# EAGLE design MJ828 - POC (EAGLE 9.4.0)
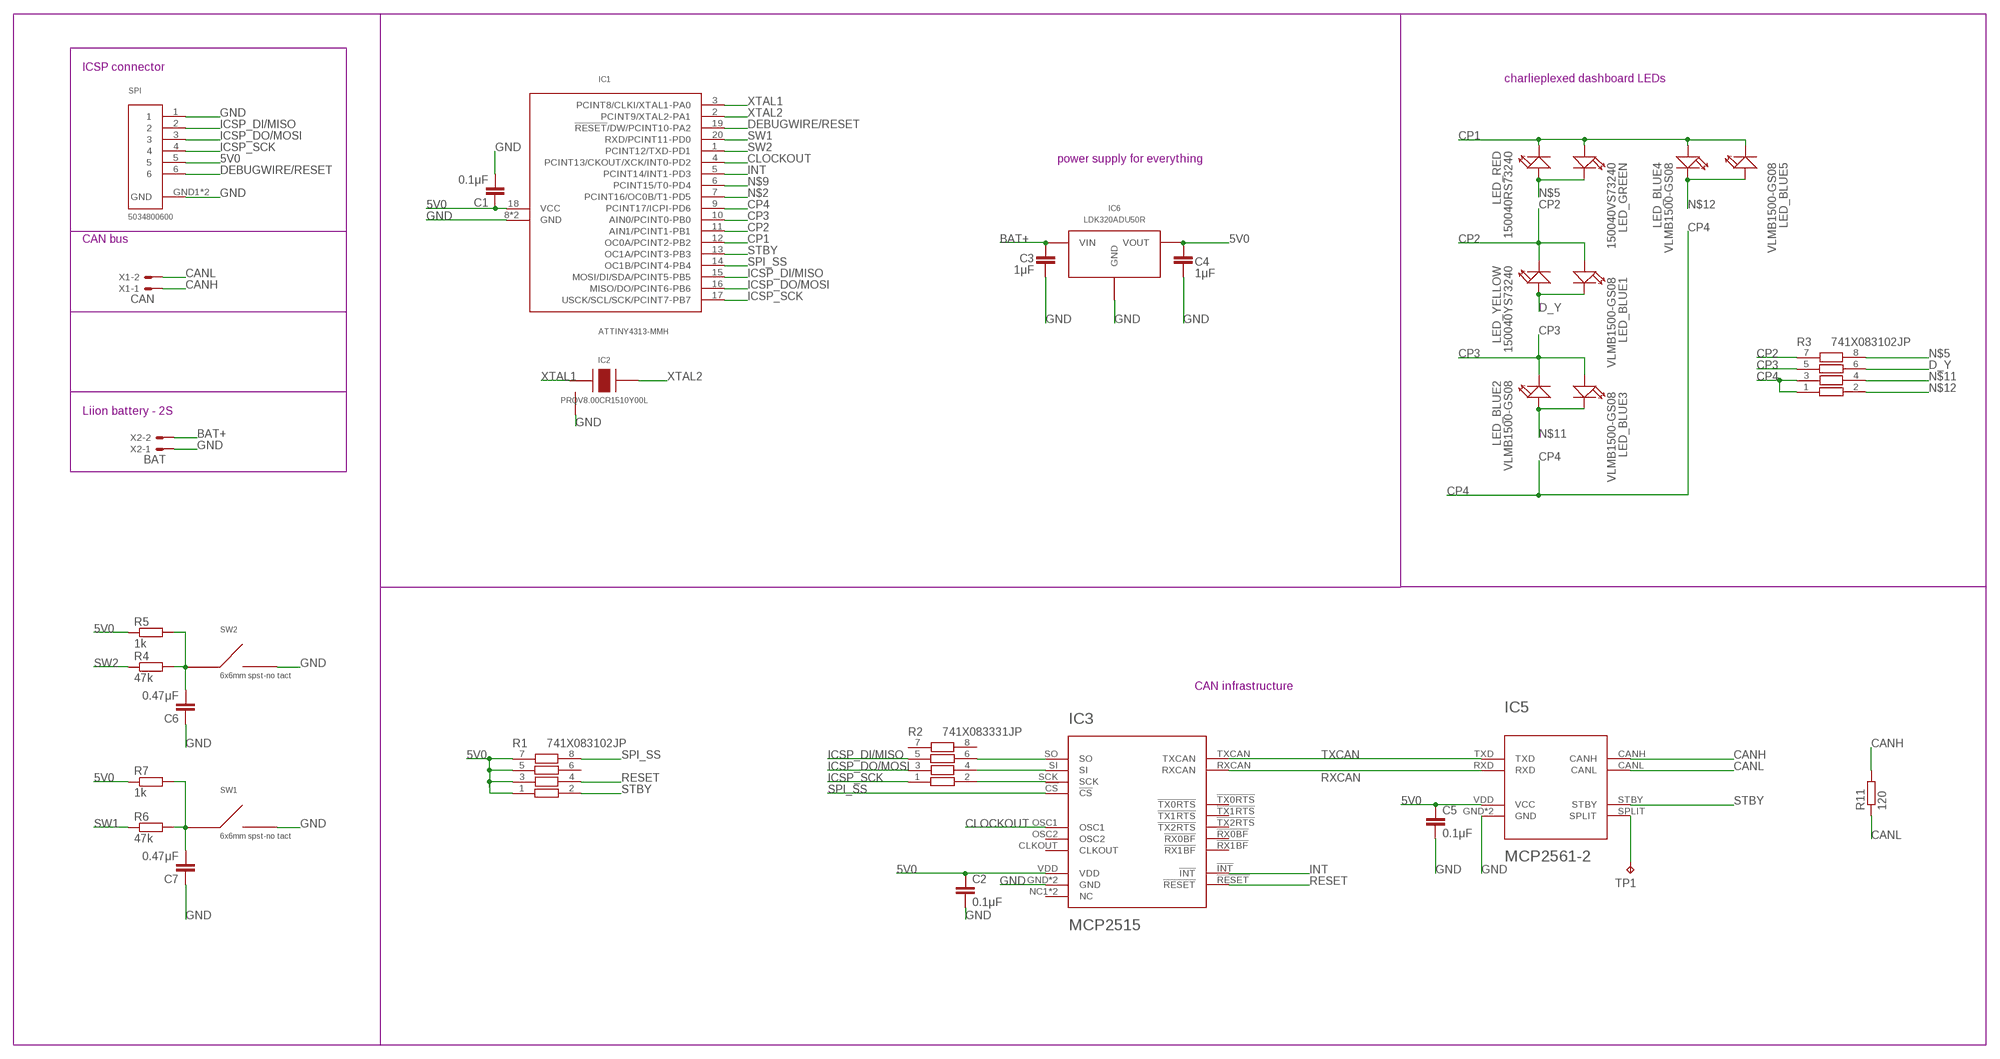
[diagram p0: schematic, sheet 1]

## Parts
C1  0.1μF  C-EUC0402  [C0402]
C2  0.1μF  C-EUC0402  [C0402]
C3  1μF  C-EUC0402  [C0402]
C4  1μF  C-EUC0402  [C0402]
C5  0.1μF  C-EUC0402  [C0402]
C6  0.47μF  C-EUC0402  [C0402]
C7  0.47μF  C-EUC0402  [C0402]
IC1  ATTINY4313-MMH  ATTINY4313VQFN-20  [VQFN-20]
IC2  PRQV8.00CR1510Y00L  PRQV  [SMT]
IC3  MCP2515  MCP2515-I-ML  [QFN20]
IC5  MCP2561-2  [DFN10]
IC6  LDK320ADU50R  LDO  [SOT-89]
LED_BLUE1  VLMB1500-GS08  SMD-LED-CLEAR-BLUE(0402)  [LED-0402]
LED_BLUE2  VLMB1500-GS08  SMD-LED-CLEAR-BLUE(0402)  [LED-0402]
LED_BLUE3  VLMB1500-GS08  SMD-LED-CLEAR-BLUE(0402)  [LED-0402]
LED_BLUE4  VLMB1500-GS08  SMD-LED-CLEAR-BLUE(0402)  [LED-0402]
LED_BLUE5  VLMB1500-GS08  SMD-LED-CLEAR-BLUE(0402)  [LED-0402]
LED_GREEN  150040VS73240  SMD-LED-CLEAR-BLUE(0402)  [LED-0402]
LED_RED  150040RS73240  SMD-LED-CLEAR-BLUE(0402)  [LED-0402]
LED_YELLOW  150040YS73240  SMD-LED-CLEAR-BLUE(0402)  [LED-0402]
R1  741X083102JP  741X083331JP  [0402]
R2  741X083331JP  [0402]
R3  741X083102JP  741X083331JP  [0402]
R4  47k  R-EU_R0402  [R0402]
R5  1k  R-EU_R0402  [R0402]
R6  47k  R-EU_R0402  [R0402]
R7  1k  R-EU_R0402  [R0402]
R11  120  R-EU_R0805  [R0805]
SPI  5034800600  [SMT]
SW1  6x6mm spst-no tact  TL3305-844809  [SMD]
SW2  6x6mm spst-no tact  TL3305-844809  [SMD]
TP1  TPB2,54  [B2,54]
X1  CAN  22-23-2021  [22-23-2021]
X2  BAT  22-23-2021  [22-23-2021]

## Nets
5V0 [5V0CAN]: C1.1 C2.1 C4.2 C5.1 IC1.18(VCC) IC3.VDD IC5.VDD(VCC) IC6.VOUT R1.1 R1.3 R1.5 R1.7 R5.1 R7.1 SPI.5
BAT+ [currett-0.45]: C3.1 IC6.VIN X2.2
CANH [signal]: IC5.CANH R11.2 X1.1
CANL [signal]: IC5.CANL R11.1 X1.2
CLOCKOUT [signal]: IC1.4(PCINT13/CKOUT/XCK/INT0-PD2) IC3.OSC1
CP1 [signal]: IC1.12(OC0A/PCINT2-PB2) LED_BLUE4.+ LED_BLUE5.- LED_GREEN.+ LED_RED.-
CP2 [signal]: IC1.11(AIN1/PCINT1-PB1) LED_BLUE1.+ LED_YELLOW.- R3.7
CP3 [signal]: IC1.10(AIN0/PCINT0-PB0) LED_BLUE2.- LED_BLUE3.+ R3.5
CP4 [signal]: IC1.9(PCINT17/ICPI-PD6) R3.1 R3.3
D_Y [signal]: LED_BLUE1.- LED_YELLOW.+ R3.6
DEBUGWIRE/RESET [signal]: IC1.19(!RESET!/DW/PCINT10-PA2) SPI.6
GND: C1.2 C2.2 C3.2 C4.1 C5.2 C6.1 C7.1 IC1.8(GND) IC1.GND IC2.GND IC3.GND IC3.GND6(GND) IC5.GND IC5.VSS(GND) IC6.GND SPI.1 SPI.GND1(GND) SPI.GND2(GND) SW1.3 SW1.4 SW2.3 SW2.4 X2.1
ICSP_DI/MISO [signal]: IC1.15(MOSI/DI/SDA/PCINT5-PB5) R2.5 SPI.2
ICSP_DO/MOSI [signal]: IC1.16(MISO/DO/PCINT6-PB6) R2.3 SPI.3
ICSP_SCK [signal]: IC1.17(USCK/SCL/SCK/PCINT7-PB7) R2.1 SPI.4
INT [signal]: IC1.5(PCINT14/INT1-PD3) IC3.!INT!
N$1: C6.2 R4.2 R5.2 SW2.1 SW2.2
N$2: IC1.7(PCINT16/OC0B/T1-PD5)
N$5 [signal]: LED_GREEN.- LED_RED.+ R3.8
N$7: C7.2 R6.2 R7.2 SW1.1 SW1.2
N$9: IC1.6(PCINT15/T0-PD4)
N$11 [signal]: LED_BLUE2.+ LED_BLUE3.- R3.4
N$12 [signal]: LED_BLUE4.- LED_BLUE5.+ R3.2
RESET [signal]: IC3.!RESET! R1.4
RXCAN [signal]: IC3.RXCAN IC5.RXD
SPI_SCK [signal]: IC3.SCK R2.2
SPI_SI [signal]: IC3.SI R2.4
SPI_SO [signal]: IC3.SO R2.6
SPI_SS [signal]: IC1.14(OC1B/PCINT4-PB4) IC3.!CS! R1.8
SPLIT: IC5.SPLIT TP1.TP
STBY [signal]: IC1.13(OC1A/PCINT3-PB3) IC5.STBY R1.2
SW1 [signal]: IC1.20(RXD/PCINT11-PD0) R6.1
SW2 [signal]: IC1.1(PCINT12/TXD-PD1) R4.1
TXCAN [signal]: IC3.TXCAN IC5.TXD
XTAL1 [signal]: IC1.3(PCINT8/CLKI/XTAL1-PA0) IC2.XTAL1
XTAL2 [signal]: IC1.2(PCINT9/XTAL2-PA1) IC2.XTAL2
Unconnected: IC3.!RX0BF! IC3.!RX1BF! IC3.!TX0RTS! IC3.!TX1RTS! IC3.!TX2RTS! IC3.CLKOUT IC3.NC1(NC) IC3.NC2(NC) IC3.OSC2 R1.6 R2.7 R2.8

## Notes on the sheet
- ICSP connector
- charlieplexed dashboard LEDs
- power supply for everything
- CAN bus
- Liion battery - 2S
- CAN infrastructure

## Library data of the parts
C1-C7 = rcl:C-EU: CAPACITOR, European symbol; SPICEPREFIX: C
IC1 = ATtiny4313 microcontroller:ATTINY4313; SPICEPREFIX: X
IC2 = PRQV8.00CR1510Y00L - 8MHz resonator:PRQV
IC3 = MCP2515-I-ML - Standalonce CAN Controller with SPI Interface:MCP2515-I-ML
IC5 = MCP2561-2 - High-Speed CAN Transceiver:MCP2561-2
IC6 = LDO SOT-89:LDO
LED_BLUE1-LED_BLUE5 LED_GREEN LED_RED LED_YELLOW = Seeed-LED:SMD-LED-CLEAR-BLUE(0402): 304090075; MPN: BL-HB337A-AV-TRB; VALUE: BLUE-0402
R1-R3 = 741X083331JP Resistor Array:741X083331JP
R4-R7 R11 = rcl:R-EU_: RESISTOR, European symbol; SPICEPREFIX: R
SPI = 5034800600 FPC Connector:5034800600
SW1 SW2 = TL3305-844809 SPST-NO Tact Switch:TL3305-844809
TP1 = testpad:TP: Test pad
X1 X2 = con-molex:22-23-2021: .100" (2.54mm) Center Header - 2 Pin; MF: MOLEX; MPN: 22-23-2021; OC_FARNELL: 1462926; OC_NEWARK: 25C3832

## Net classes
0 GND: width 0.254 mm, drill 0.254 mm, clearance 0.127 mm
1 VCC: width 0.254 mm, drill 0.254 mm, clearance 0.127 mm
2 signal: width 0.127 mm, drill 0.254 mm, clearance 0.127 mm
3 5V0CAN: width 0.3 mm, drill 0.35 mm, clearance 0.2 mm
4 5V0_μC: width 0.25 mm, drill 0.25 mm, clearance 0.2 mm
5 currett-0.45: width 0.45 mm, drill 0.35 mm, clearance 0.2 mm

## Board
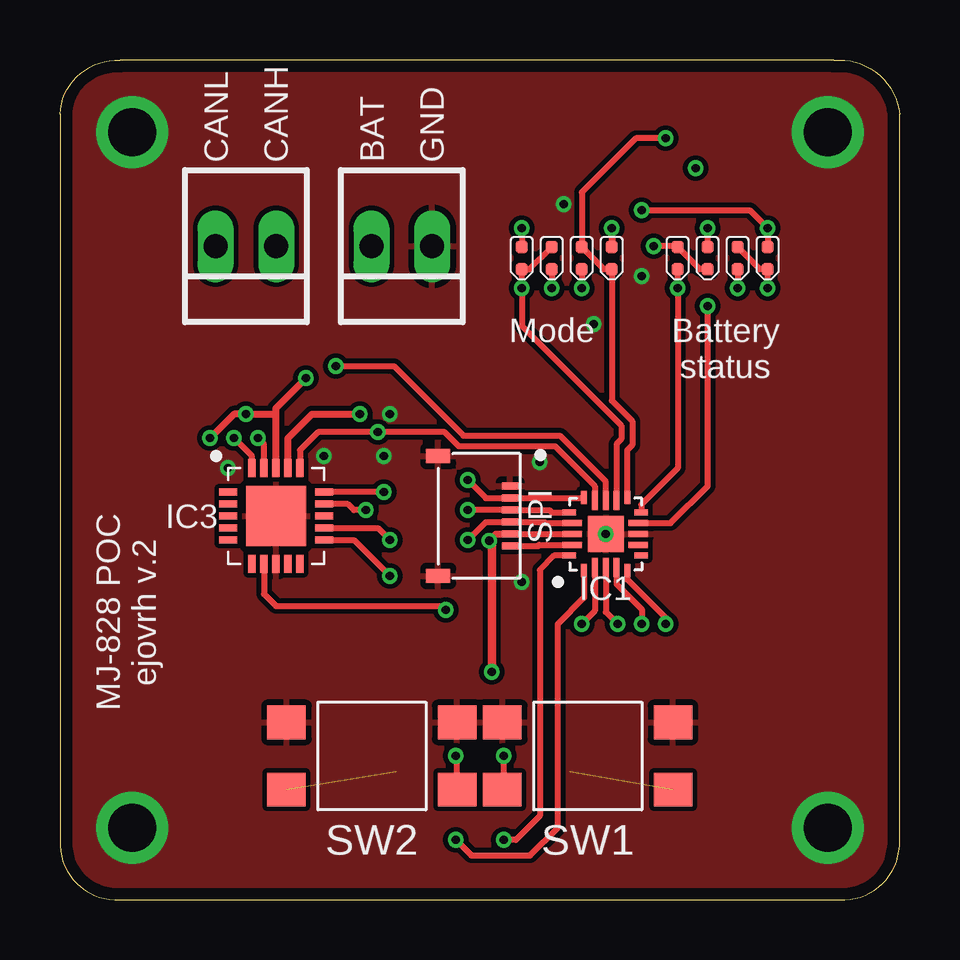
[diagram p1: board, top side]
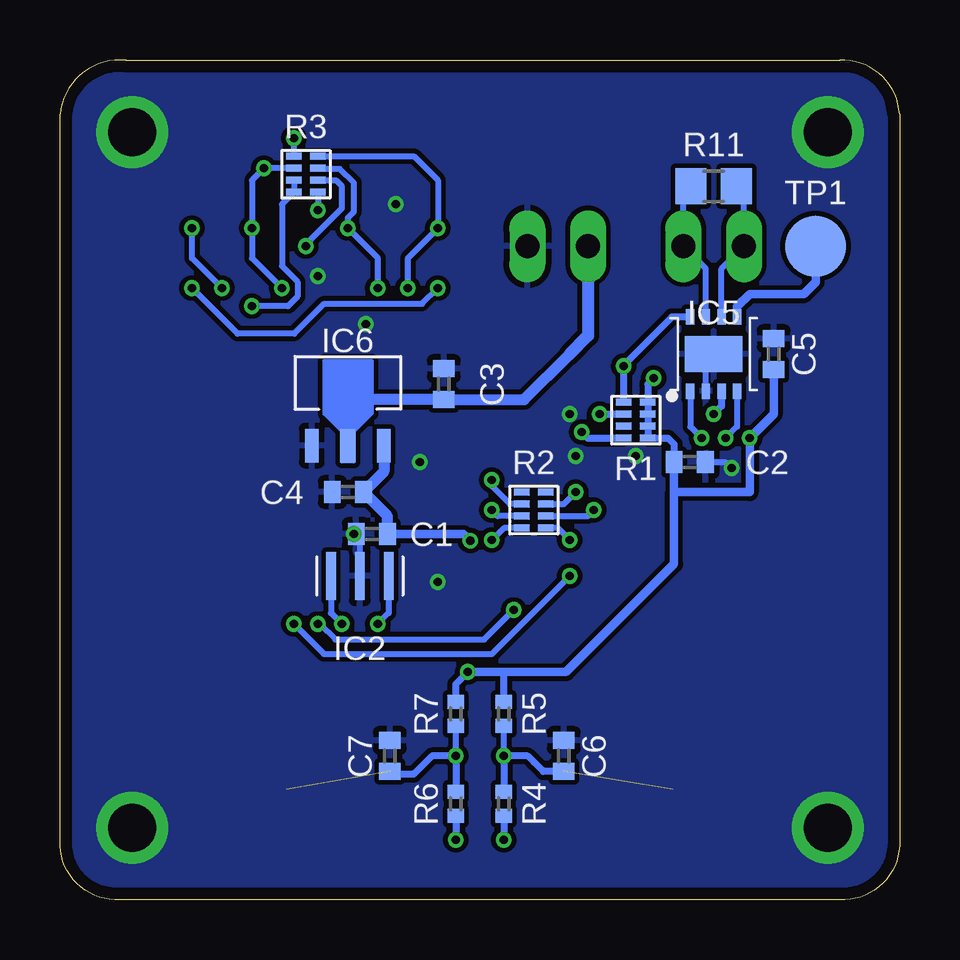
[diagram p2: board, bottom side, seen from below]

Size 35 x 35.01 mm. Coordinates in mm from the lower left corner, seen from the top.
Outline: 2.5,0 32.5,0
Outline: 35,2.25 35,32.75
Outline: 32.25,35 2.5,35 arc90 0,32.75 0,2.25
Outline: 32.25,35 arc-90 35,32.75
Outline: 32.5,0 arc90 35,2.25
Outline: 0,2.25 arc90 2.5,0
Outline: 32.25,35 arc-90 35,32.75
Outline: 32.5,0 arc90 35,2.25
Outline: 0,2.25 arc90 2.5,0
Copper layers (1*16): Top 0.035mm / dielectric 1.5mm / Bottom 0.035mm
Design rules "markovac_2layer": minimum track width 0.2mm, minimum drill 0.35mm, track to track 0.2mm, track to pad 0.2mm, pad to pad 0.2mm, via to via 0.2mm, smd to smd 0.2mm, copper to edge 0.5mm, drill to drill 8mil, minimum pad ring 0.15mm, minimum via ring 0.15mm, stop-mask expansion 4mil, vias tented up to drill 0.34mm, thermal gap 10mil

### Footprints (pad centres in the part's own frame; a part is rotated, then mirrored left to right if it is on the bottom)
C0402 = smd 0.7 x 0.9: 1 -0.65,0; 2 0.65,0
VQFN-20 = smd 0.55 x 0.25: 1 -1.52,0.9; 5 -1.52,-0.9; 11 1.52,-0.9; 15 1.52,0.9 | smd 0.8 x 0.25: 2 -1.4,0.45; 3 -1.4,0; 4 -1.4,-0.45; 12 1.4,-0.45; 13 1.4,0; 14 1.4,0.45 | smd 0.25 x 0.55: 6 -0.9,-1.48; 10 0.9,-1.48; 16 0.9,1.52; 20 -0.9,1.52 | smd 0.25 x 0.8: 7 -0.45,-1.35; 8 0,-1.35; 9 0.45,-1.35; 17 0.45,1.4; 18 0,1.4; 19 -0.45,1.4 | smd 1.5 x 1.5: GND 0,0
SMT = smd 0.4 x 2: GND 0,0; XTAL1 -1.2,0; XTAL2 1.2,0
QFN20 = smd 0.3 x 0.75: !CS! 1,2; !RESET! 0.5,2; !RX0BF! 1,-2; !RX1BF! 0.5,-2; GND6 0,-2; OSC1 -0.5,-2; OSC2 -1,-2; RXCAN -1,2; TXCAN -0.5,2; VDD 0,2 | smd 0.75 x 0.3: !INT! 2,-1; !TX0RTS! -2,0.5; !TX1RTS! -2,0; !TX2RTS! -2,-1; CLKOUT -2,1; NC1 -2,-0.5; NC2 2,0; SCK 2,-0.5; SI 2,0.5; SO 2,1 | smd 2.5 x 2.5: GND 0,0
DFN10 = smd 0.35 x 0.65: CANH -0.325,1.55; CANL 0.325,1.55; RXD 0.975,-1.55; SPLIT 0.975,1.55; STBY -0.975,1.55; TXD -0.975,-1.55; VDD 0.325,-1.55; VSS -0.325,-1.55 | smd 2.4 x 1.5: GND 0,0
SOT-89 = smd 0.57 x 1.4: GND -1.5,0.685; VOUT 1.5,0.685 | smd 0.65 x 1.4: VIN 0,0.685
LED-0402 = smd 0.5 x 0.5: + -0.463,0; - 0.463,0
0402 = smd 0.65 x 0.3: 1 -0.5,-0.75; 2 0.5,-0.75; 3 -0.5,-0.25; 4 0.5,-0.25; 5 -0.5,0.25; 6 0.5,0.25; 7 -0.5,0.75; 8 0.5,0.75
R0402 = smd 0.6 x 0.7: 1 -0.5,0; 2 0.5,0
R0805 = smd 1.3 x 1.5: 1 -0.95,0; 2 0.95,0
SMT' = smd 0.3 x 0.7: 1 -1.25,1.27; 2 -0.75,1.27; 3 -0.25,1.27; 4 0.25,1.27; 5 0.75,1.27; 6 1.25,1.27 | smd 0.6 x 1: GND1 -2.5,-1.73; GND2 2.5,-1.73
SMD = smd 1.6 x 1.4: 1 -3.556,-1.397; 2 3.556,-1.397; 3 -3.556,1.397; 4 3.556,1.397
B2,54 = smd 2.54 x 2.54: TP 0,0
22-23-2021 = drill 1 long: 1 -1.27,0; 2 1.27,0

### Placement (x,y rotation side)
C1  22,15.25 180 bottom
C2  8.75,18.25 0 bottom
C3  19,21.5 90 bottom
C4  23,17 0 bottom
C5  5.25,22.75 90 bottom
C6  14,6 270 bottom
C7  21.25,6 270 bottom
IC1  22.75,15.25 90 top
IC2  PBRC8.00GR50X000  [SMT]  22.5,13.5 0 bottom
IC3  9,16 0 top
IC5  7.75,22.75 0 bottom
IC6  23,18.25 0 bottom
LED_BLUE1  21.75,26.75 270 top
LED_BLUE2  25.75,26.75 270 top
LED_BLUE3  27,26.75 270 top
LED_BLUE4  28.25,26.75 270 top
LED_BLUE5  29.5,26.75 270 top
LED_GREEN  20.5,26.75 270 top
LED_RED  19.25,26.75 270 top
LED_YELLOW  23,26.75 270 top
R1  11,20 180 bottom
R2  15.25,16.25 0 bottom
R3  24.75,30.25 0 bottom
R4  16.5,4 90 bottom
R5  16.5,7.75 270 bottom
R6  18.5,4 90 bottom
R7  18.5,7.75 270 bottom
R11  7.75,29.75 180 bottom
SPI  5034800600  [SMT']  17.5,16 270 top
SW1  TL3305CF160QG  [SMD]  22,6 0 top
SW2  TL3305CF160QG  [SMD]  13,6 0 top
TP1  3.5,27.25 0 bottom
X1  7.75,27.25 180 top
X2  14.25,27.25 180 top

### Tracks (layer width: path | path; a pad name or v marks a point on that pad's centre or on a via)
5V0  (via drill 0.35)
  Top 0.25: SPI.5 C1.1
  Top 0.3: v6.25,19.25 7.25,20.25 v7.75,20.25 9,20.25 | IC3.VDD 9,20.25 | v17.89,14.98 18.17,15.25 SPI.5 | 9,20.25 9,20.5 v10.25,21.75
  Top 0.35: v18,9.5 18,14.98 v17.89,14.98
  Bottom 0.3: IC5.VDD 7.42,20.58 v7.75,20.25 | C2.1 9.4,19 9.65,19.25 R1.7 R1.5 R1.3 R1.1 10.5,21.5 v10.25,21.75 | R7.1 18.5,9 v18,9.5 | R5.1 16.5,9.5
  Bottom 0.35: 9.4,17 6.25,17 v6.25,19.25 5.25,20.25 C5.1 | C2.1 9.4,17 | 9.4,17 9.4,14 13.9,9.5 16.5,9.5 v18,9.5 | v17.89,14.98 18.17,15.25 C1.1
  Bottom 0.45: C1.1 21.35,16 C4.2 21.5,17.85 IC6.VOUT
BAT+
  Bottom 0.45: IC6.VIN 23,20.3 22.44,20.85 C3.1 15.65,20.85 13.75,22.75
  Bottom 0.508: X2.2 12.98,23.52 13.75,22.75
CANH
  Bottom 0.25: R11.2 9.02,29.75 X1.1 8.07,26.31 IC5.CANH
CANL
  Bottom 0.25: R11.1 6.48,29.75 X1.2 7.42,26.31 IC5.CANL
CLOCKOUT  (via drill 0.35)
  Top 0.25: IC1.4 23.2,13.17 24.25,12.12 v24.25,11.5 | v16.09,12.09 15.92,12.25 9,12.25 8.5,12.75 IC3.OSC1
  Bottom 0.25: v24.25,11.5 24.17,11.5 23.52,10.85 17.32,10.85 v16.09,12.09
CP1  (via drill 0.35)
  Top 0.254: IC1.12 23.2,19 23.4,19.2 23.4,19.77 19.25,23.92 v19.25,25.5 LED_RED.- 19.57,26.29 LED_GREEN.+ | LED_BLUE4.+ 29.18,26.29 LED_BLUE5.- v29.5,25.5
  Bottom 0.25: 25.23,23.6 23.98,24.85 19.9,24.85
  Bottom 0.254: v29.5,25.5 27.6,23.6 25.23,23.6 | 19.9,24.85 v19.25,25.5
CP2  (via drill 0.35)
  Top 0.25: IC1.11 23.65,18.75 23.86,18.96 23.86,19.96
  Top 0.254: v25.25,31.75 24,31.75 21.75,29.5 LED_BLUE1.+ 22.68,26.29 LED_YELLOW.- 23,20.82 23.86,19.96
  Bottom 0.254: R3.7 v25.25,31.75
CP3  (via drill 0.35)
  Top 0.254: LED_BLUE2.- v25.75,25.5 25.75,18 24.23,16.48 IC1.10 | LED_BLUE3.+ v27,28
  Bottom 0.254: v25.75,25.5 27,26.75 v27,28 27,30 v26.5,30.5 R3.5
CP4  (via drill 0.35)
  Top 0.254: IC1.9 25.45,15.7 27,17.25 v27,24.75
  Bottom 0.254: R3.3 R3.1 25.75,29 25.75,26.42 25.1,25.77 25.1,25.15 25.5,24.75 v27,24.75
D_Y  (via drill 0.35)
  Top 0.254: LED_BLUE1.- v21.75,25.5
  Top 0.3: v23,28 LED_YELLOW.+
  Bottom 0.25: v21.75,25.5 21.75,26.75 v23,28 | 22.75,28.69 22.75,29.89
  Bottom 0.254: R3.6 24.23,30.48 23.34,30.48 22.75,29.89 | v23,28 23,28.44 22.75,28.69
DEBUGWIRE/RESET
  Top 0.25: SPI.6 19.93,14.75 19.98,14.8 IC1.19
GND  (via drill 0.35, 2)
  Bottom 0.25: IC2.GND 22.5,15.1 C1.2 | IC5.VSS 8.07,22.43 IC5.GND | C2.2 7.25,18.25 v7,18
  other vias: 3,32 3,3 32,3 32,32 19.25,13.25 20,18.25 13.5,18.5 13.75,20.25 22.75,15.25 11,18.5 21,29 24.25,26 22.25,24
  pour Top: 0,35 35,35 35,0 0,0
  pour Bottom: 0,35 0,0 35,0 35,35
ICSP_DI/MISO  (via drill 0.35)
  Top 0.25: IC1.15 21.83,16.75 SPI.2 17.75,16.75 v17,17.5
  Bottom 0.25: v17,17.5 17,17.25 16.25,16.5 R2.5
ICSP_DO/MOSI  (via drill 0.35)
  Top 0.25: IC1.16 20.5,16.15 20.4,16.25 SPI.3 v17,16.25
  Bottom 0.25: v17,16.25 16.75,16 R2.3
ICSP_SCK  (via drill 0.35)
  Top 0.25: IC1.17 20.25,15.7 20.2,15.75 SPI.4 17.75,15.75 v17,15
  Bottom 0.25: v17,15 16.5,15.5 R2.1
INT  (via drill 0.35)
  Top 0.25: IC3.!INT! 12.25,15 v13.75,13.5 | IC1.5 23.65,13.35 25.25,11.75 v25.25,11.5
  Bottom 0.25: v13.75,13.5 17,10.25 24,10.25 v25.25,11.5
N$1  (via drill 0.35)  (1 unrouted)
  Top 0.254: SW2.2 16.56,5.95 v16.5,6
  Bottom 0.254: v16.5,6 R5.2
  Bottom 0.3: R4.2 v16.5,6 15.5,6 15.25,5.75 14.85,5.35 C6.2
N$5  (via drill 0.35)
  Top 0.254: LED_GREEN.- v20.5,25.5 | v19.25,28 LED_RED.+
  Bottom 0.254: v20.5,25.5 20.5,26.75 v19.25,28 19.25,30 20.25,31 R3.8
N$7  (via drill 0.35)  (1 unrouted)
  Top 0.254: SW1.1 18.5,4.66 v18.5,6
  Bottom 0.254: v18.5,6 R7.2
  Bottom 0.3: R6.2 v18.5,6 19.5,6 20.25,5.25 21.15,5.25 C7.2
N$11  (via drill 0.35)
  Top 0.25: 25.71,27.25 v24.75,27.25
  Top 0.254: LED_BLUE3.- 26.68,26.29 LED_BLUE2.+ 25.71,27.25
  Bottom 0.25: 24.75,27.33 23.25,28.83
  Bottom 0.254: R3.4 23.5,30 23.25,29.75 23.25,28.83 | v24.75,27.25 24.75,27.33
N$12  (via drill 0.35)
  Top 0.254: LED_BLUE4.- v28.25,25.5 | LED_BLUE5.+ v29.5,28 28.75,28.75 v24.25,28.75
  Bottom 0.254: v28.25,25.5 29.5,26.75 v29.5,28 | R3.2 v24.25,28.75
RESET  (via drill 0.35)
  Top 0.3: IC3.!RESET! 9.5,19.25 10.5,20.25 v12.5,20.25
  Bottom 0.3: v12.5,20.25 R1.4
RXCAN  (via drill 0.35)
  Top 0.25: IC3.RXCAN 8,18.5 v7.25,19.25
  Bottom 0.25: IC5.RXD 6.78,19.73 v7.25,19.25
SPI_SCK  (via drill 0.35)
  Top 0.25: IC3.SCK 13.25,15.5 v13.75,15
  Bottom 0.25: v13.75,15 14.25,15.5 R2.2
SPI_SI  (via drill 0.35)
  Top 0.254: v12.75,16.25 12.25,16.25 12,16.5 IC3.SI
  Bottom 0.25: v12.75,16.25 13,16 R2.4
SPI_SO  (via drill 0.35)
  Top 0.254: v13.5,17 IC3.SO
  Bottom 0.25: v13.5,17 14,16.5 R2.6
SPI_SS  (via drill 0.35)
  Top 0.25: IC3.!CS! 10,18.75 10.75,19.5 v13.25,19.5 16.03,19.5 16.63,18.9 20.65,18.9 22.3,17.25 IC1.14
  Bottom 0.3: v13.25,19.5 13,19.25 R1.8
SPLIT
  Bottom 0.35: IC5.SPLIT 6.78,24.73 6.25,25.25 4,25.25 3.5,25.75 TP1.TP
STBY  (via drill 0.35)
  Top 0.25: IC1.13 22.75,17.44 20.83,19.35 16.82,19.35 13.92,22.25 v11.5,22.25
  Bottom 0.25: v11.5,22.25 11.5,22.3
  Bottom 0.3: R1.2 11.5,22.3 9.5,24.3 IC5.STBY
SW1  (via drill 0.35)
  Top 0.25: IC1.20 20.6,14.35 20,13.75 20,3.5 19,2.5 v18.5,2.5
  Bottom 0.3: R6.1 v18.5,2.5
SW2  (via drill 0.35)
  Top 0.25: IC1.1 21.85,12.6 20.75,11.5 20.75,3 19.6,1.85 17.15,1.85 v16.5,2.5
  Bottom 0.3: R4.1 v16.5,2.5
TXCAN  (via drill 0.35)
  Top 0.25: IC3.TXCAN 8.5,19 v8.25,19.25
  Bottom 0.25: IC5.TXD 8.72,19.73 v8.25,19.25
XTAL1  (via drill 0.35)
  Top 0.25: IC1.3 22.75,12 v23.25,11.5
  Bottom 0.25: IC2.XTAL1 23.7,11.95 v23.25,11.5
XTAL2  (via drill 0.35)
  Top 0.25: IC1.2 22.3,12.05 v21.75,11.5
  Bottom 0.25: IC2.XTAL2 21.3,11.95 v21.75,11.5

### Text on the board
tPlace: BAT | GND | Mode | Battery / status | MJ-828 POC / ejovrh v.2
tNames: CANL | CANH